# EAGLE design Arduino-Mini-v5 (EAGLE 6.1)
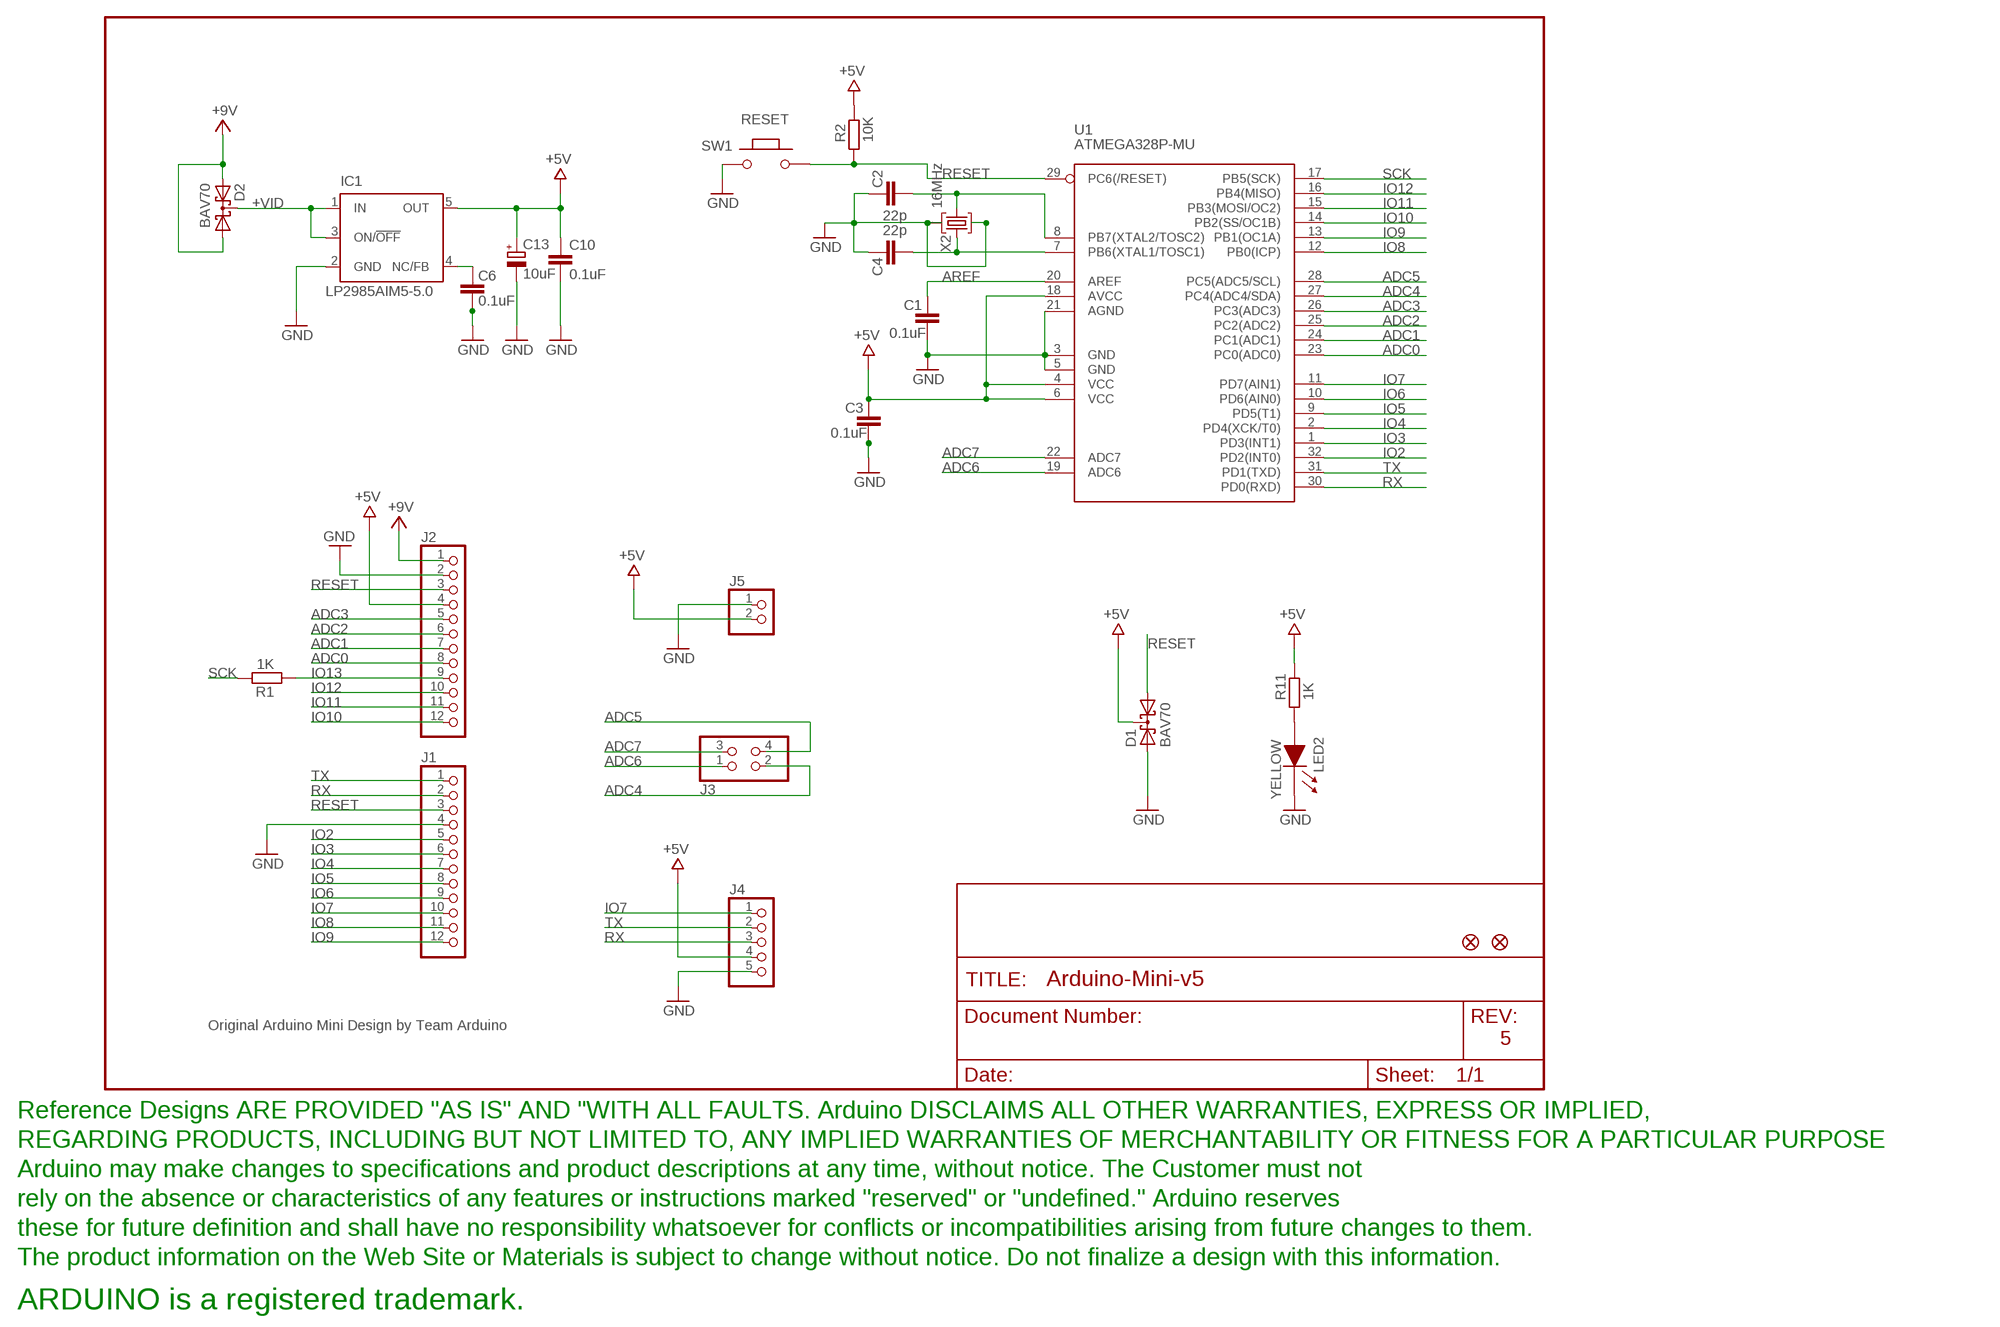
[diagram p0: schematic, sheet 1]

## Parts
C1  0.1uF  C-EUC0603  [C0603-ROUND]
C2  22p  C-EUC0603  [C0603-ROUND]
C3  0.1uF  C-EUC0603  [C0603-ROUND]
C4  22p  C-EUC0603  [C0603-ROUND]
C6  0.1uF  C-EUC0603  [C0603-ROUND]
C10  0.1uF  C-EUC0603  [C0603-ROUND]
C13  10uF  CPOL-EUSMCB  [SMC_B]
D1  BAV70  BAS70-05  [SOT23]
D2  BAV70  BAS70-05  [SOT23]
IC1  LP2985AIM5-5.0  LP2985-XXDBVR50  [SOT23-DBV]
J1  PINHD-1X12  [1X12]
J2  PINHD-1X12  [1X12]
J3  PINHD-2X2  [2X02]
J4  PINHD-1X5  [1X5]
J5  PINHD-1X2  [1X2]
LED2  YELLOW  MYSMD_LED0805  [SMD_LED0805]
R1  1K  R-EU_R0603  [R0603-ROUND]
R2  10K  R-EU_R0603  [R0603-ROUND]
R11  1K  R-EU_R0603  [R0603-ROUND]
SW1  RESET  MYSMD_PB157  [SMD_157SW]
U1  ATMEGA328P-MU  ATMEGAXX8-MU  [MLF32-M1-A]
U$2  FIDUCIAL1X2  [FIDUCIAL-1X2]
U$4  FIDUCIAL1X2  [FIDUCIAL-1X2]
U$11  DISCLAIMER  [DISCLAIMER]
X2  16MHz  CRYSTAL-3.2-2.5  [CRYSTAL-3.2-2.5]

## Nets
+5V: C3.2 C10.1 C13.+ D1.3(C) IC1.5(OUT) J2.4 J4.4 J5.2 R2.2 R11.2 U1.4(VCC) U1.6(VCC) U1.18(AVCC)
+VID: D2.3(C) IC1.1(IN) IC1.3(ON/!OFF)
ADC0: J2.8 U1.23(PC0(ADC0))
ADC1: J2.7 U1.24(PC1(ADC1))
ADC2: J2.6 U1.25(PC2(ADC2))
ADC3: J2.5 U1.26(PC3(ADC3))
ADC4: J3.2 U1.27(PC4(ADC4/SDA))
ADC5: J3.4 U1.28(PC5(ADC5/SCL))
ADC6: J3.1 U1.19(ADC6)
ADC7: J3.3 U1.22(ADC7)
AREF: C1.2 U1.20(AREF)
GND: C1.1 C2.2 C3.1 C4.2 C6.1 C10.2 C13.- D1.1(A1) IC1.2(GND) J1.4 J2.2 J4.5 J5.1 LED2.1(CA) SW1.1 U1.3(GND) U1.5(GND) U1.21(AGND) X2.2(GND) X2.4(GND)
IO2: J1.5 U1.32(PD2(INT0))
IO3: J1.6 U1.1(PD3(INT1))
IO4: J1.7 U1.2(PD4(XCK/T0))
IO5: J1.8 U1.9(PD5(T1))
IO6: J1.9 U1.10(PD6(AIN0))
IO7: J1.10 J4.1 U1.11(PD7(AIN1))
IO8: J1.11 U1.12(PB0(ICP))
IO9: J1.12 U1.13(PB1(OC1A))
IO10: J2.12 U1.14(PB2(SS/OC1B))
IO11: J2.11 U1.15(PB3(MOSI/OC2))
IO12: J2.10 U1.16(PB4(MISO))
IO13: J2.9 R1.1
N$1: C4.1 U1.7(PB6(XTAL1/TOSC1)) X2.1(C1)
N$2: C2.1 U1.8(PB7(XTAL2/TOSC2)) X2.3(C2)
N$3: C6.2 IC1.4(NC/FB)
N$4: LED2.2(AN) R11.1
RESET: D1.2(A2) J1.3 J2.3 R2.1 SW1.2 U1.29(PC6(/RESET))
RX: J1.2 J4.3 U1.30(PD0(RXD))
SCK: R1.2 U1.17(PB5(SCK))
TX: J1.1 J4.2 U1.31(PD1(TXD))
VCC: D2.1(A1) D2.2(A2) J2.1 ; supply symbol labelled +9V

## Notes on the sheet
- Original Arduino Mini Design by Team Arduino
- 5

## Library data of the parts
C1-C4 C6 C10 = Smartprj:C-EU: CAPACITOR, European symbol
C13 = Smartprj:CPOL-EU: POLARIZED CAPACITOR, European symbol
D1 D2 = diode:BAS70-05: Silicon Schottky Diodes General-purpose diode for high-speed switching
IC1 = Smartprj:LP2985-XXDBVR: ULTRALOW-POWER 50-mA LOW-DROPOUT LINEAR REGULATORS 50-mA Low-Dropout Regulator Source: http://focus.ti.com/lit/ds/symlink/tps77001.pdf
J1 J2 = Smartprj:PINHD-1X12: PIN HEADER
J3 = pinhead:PINHD-2X2: PIN HEADER
J4 = Smartprj:PINHD-1X5: PIN HEADER
J5 = LALA1:PINHD-1X2: PIN HEADER
LED2 = Smartprj:MYSMD_LED0805
R1 R2 R11 = Smartprj:R-EU_: RESISTOR, European symbol
SW1 = Smartprj:MYSMD_PB157
U1 = Smartprj:ATMEGAXX8: MICROCONTROLLER 8 Kbytes FLASH 1 kbytes SRAM 512 bytes EEPROM USART 6-channel 10 bit ADC 2-channel 8 bit ADC Source: avr.lbr
U$2 U$4 = SparkFun:FIDUCIAL: Fiducial Alignment Points Various fiducial points for machine vision alignment.
U$11 = Smartprj:DISCLAIMER
X2 = Smartprj:CRYSTAL-3.2-2.5

## Net classes
0 default: width 0.203 mm
1 vcc: width 0.254 mm

## Board
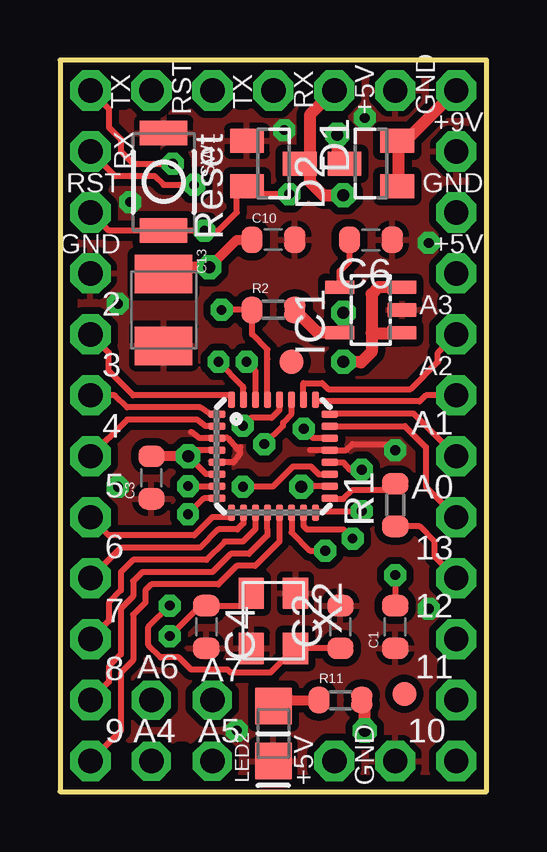
[diagram p1: board, top side]
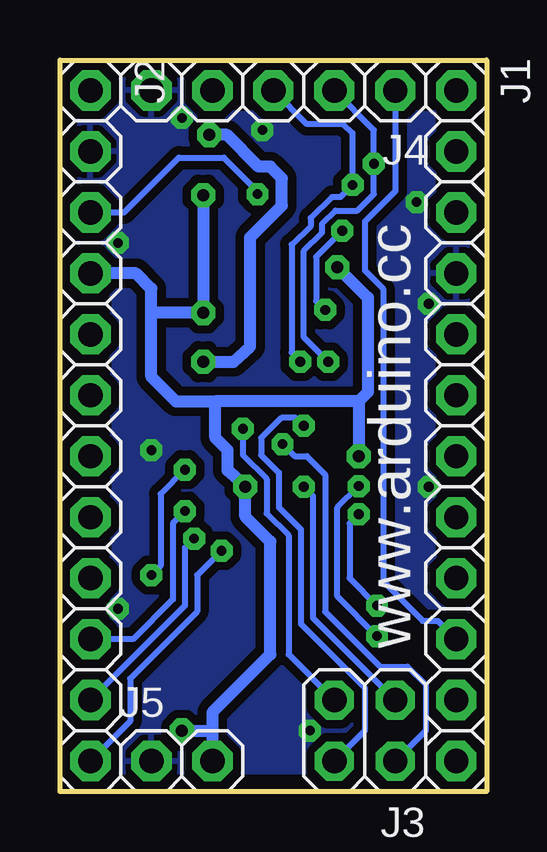
[diagram p2: board, bottom side, seen from below]

Size 17.78 x 30.48 mm. Coordinates in mm from the lower left corner, seen from the top.
Outline: 0,30.48 0,0 17.78,0 17.78,30.48 0,30.48
Copper layers (1*16): Top 0.035mm / dielectric 1.5mm / Bottom 0.035mm
Design rules: minimum track width 10mil, minimum drill 16mil, track to track 8mil, track to pad 8mil, pad to pad 8mil, via to via 8mil, smd to smd 8mil, copper to edge 24mil, drill to drill 8mil, minimum pad ring 12mil, minimum via ring 10mil, stop-mask expansion 2mil, vias tented up to drill 20mil, thermal gap 10mil
tRestrict: area 16,5 to 17.3,5.2; area 16.1,2.4 to 17.4,2.7; area 16,7.5 to 17.3,7.7; area 16,20.2 to 17.3,20.4; area 16,22.7 to 17.3,23; area 7.5,28.7 to 7.7,30; area 5,28.7 to 5.2,30; area 2.4,28.7 to 2.7,30; area 0.5,25.3 to 1.8,25.5; area 0.5,12.6 to 1.8,12.8; area 5,0.5 to 5.2,1.8; area 2.4,0.5 to 2.7,1.8
bRestrict: area 0.5,15.1 to 1.8,15.4; area 0.5,17.7 to 1.8,17.9; area 0.5,25.3 to 1.8,25.5; area 0.5,27.8 to 1.8,28.1; area 2.4,28.7 to 2.7,30; area 10,28.7 to 10.3,30; area 16,20.2 to 17.3,20.4; area 16,17.7 to 17.3,17.9; area 16,15.1 to 17.3,15.4; area 16,12.6 to 17.3,12.8; area 16,10 to 17.3,10.3; area 16,7.5 to 17.3,7.7; area 0.5,12.6 to 1.8,12.8; area 0.5,10 to 1.8,10.3

### Footprints (pad centres in the part's own frame; a part is rotated, then mirrored left to right if it is on the bottom)
C0603-ROUND = smd 0.898 x 1.1: 1 -0.889,0; 2 0.889,0
SMC_B = smd 1.6 x 2.4: + -1.5,0; - 1.5,0
SOT23 = smd 1 x 1.4: 1 -0.95,-1.1; 2 0.95,-1.1; 3 0,1.1
SOT23-DBV = smd 0.55 x 1.2: 1 -0.95,-1.3; 2 0,-1.3; 3 0.95,-1.3; 4 0.95,1.3; 5 -0.95,1.3
1X12 = drill 1.016 pad 1.676 octagon: 1 -3.81,0; 2 -1.27,0; 3 1.27,0; 4 3.81,0; 5 6.35,0; 6 8.89,0; 7 11.43,0; 8 13.97,0; 9 16.51,0; 10 19.05,0; 11 21.59,0; 12 24.13,0
2X02 = drill 1.016 octagon: 1 -1.27,-1.27; 2 -1.27,1.27; 3 1.27,-1.27; 4 1.27,1.27
1X5 = drill 1.016 pad 1.676 octagon: 1 -3.81,0; 2 -1.27,0; 3 1.27,0; 4 3.81,0; 5 6.35,0
1X2 = drill 1.016 pad 1.676 octagon: 1 -3.81,0; 2 -1.27,0
SMD_LED0805 = smd 1.524 x 1.524: 1 0,0; 2 2.286,0
R0603-ROUND = smd 0.898 x 1.1: 1 -0.889,0; 2 0.889,0
SMD_157SW = smd 1.016 x 1.981: 1 -2.032,0; 2 2.032,0
MLF32-M1-A = smd 0.7 x 0.3: 1 -2.35,1.75; 2 -2.35,1.25; 3 -2.35,0.75; 4 -2.35,0.25; 5 -2.35,-0.25; 6 -2.35,-0.75; 7 -2.35,-1.25; 8 -2.35,-1.75; 17 2.35,-1.75; 18 2.35,-1.25; 19 2.35,-0.75; 20 2.35,-0.25; 21 2.35,0.25; 22 2.35,0.75; 23 2.35,1.25; 24 2.35,1.75 | smd 0.3 x 0.7: 9 -1.75,-2.35; 10 -1.25,-2.35; 11 -0.75,-2.35; 12 -0.25,-2.35; 13 0.25,-2.35; 14 0.75,-2.35; 15 1.25,-2.35; 16 1.75,-2.35; 25 1.75,2.35; 26 1.25,2.35; 27 0.75,2.35; 28 0.25,2.35; 29 -0.25,2.35; 30 -0.75,2.35; 31 -1.25,2.35; 32 -1.75,2.35
FIDUCIAL-1X2 = smd 1 x 1: 1 0,0
CRYSTAL-3.2-2.5 = smd 1.3 x 1.05: 1 -1.15,-0.925; 2 1.15,-0.925; 3 1.15,0.925; 4 -1.15,0.925

### Placement (x,y rotation side)
C1  13.97,6.86 90 top
C2  11.68,6.86 90 top
C3  3.81,13.08 90 top
C4  6.1,6.86 270 top
C6  12.95,22.99 180 top
C10  8.89,22.99 0 top
C13  4.32,20.07 270 top
D1  8.89,26.16 270 top
D2  12.95,26.16 90 top
IC1  12.95,20.07 90 top
J1  1.27,25.4 270 bottom
J2  16.51,25.4 270 bottom
J3  5.08,2.54 180 bottom
J4  7.62,29.21 180 bottom
J5  10.16,1.27 0 bottom
LED2  8.89,1.27 90 top
R1  13.97,11.94 90 top
R2  8.89,20.07 0 top
R11  11.68,3.81 0 top
SW1  4.32,25.4 270 top
U1  8.89,13.97 0 top
U$2  14.35,4.06 0 top
U$4  9.65,17.91 0 top
U$11  -7.75,-25.78 0 top  (outside the outline)
X2  8.89,7.11 270 top

### Tracks (layer width: path | path; a pad name or v marks a point on that pad's centre or on a via)
+5V  (via drill 0.5)
  Top 0.254: 6.6,13.21 U1.6 6.08,13.22 v5.33,13.97 5.59,14.22 6.35,14.22 U1.4 6.6,14.22 | U1.18 10.16,12.72 | 3.94,13.97 C3.2
  Top 0.406: v6.22,21.84 7.37,22.99 C10.1 | v5.33,13.97 3.94,13.97
  Top 0.508: 10.41,26.16 10.41,28.19 J4.4 | v11.81,24.84 10.97,24.84 10.41,25.4 10.41,26.16 | 10.41,26.16 D1.3 | v12.7,2.54 12.7,3.81 R11.2 | v6.22,21.84 4.32,21.84 C13.+ | 10.16,12.72 v10.06,12.7 | R2.2 10.72,19.13 11.64,19.13 IC1.5 11.67,19.1 | v11.81,19.94 11.81,19.15 11.38,19.1 11.67,19.1 | 11.68,19.1 11.67,19.1
  Bottom 0.508: v11.81,24.84 v11.81,19.94 13.97,19.94 | 13.97,19.94 13.97,20.95 14.61,21.59 J2.4 | 13.97,19.94 13.97,17.27 12.95,16.26 11.3,16.26 | 5.33,16.26 v5.33,13.97 | 5.33,16.26 4.95,16.64 4.95,20.57 v6.22,21.84 | 5.33,16.26 11.3,16.26 | 11.3,16.26 11.3,14.73 10.79,14.22 10.79,13.39 v10.06,12.7 10.06,11.46 9.02,10.41 9.02,5.71 11.43,3.3 11.43,2.54 | 11.43,2.54 J5.2 | v12.7,2.54 11.43,2.54
+VID  (via drill 0.5)
  Top 0.508: 14.22,19.1 IC1.1 14.22,19.1 | 14.28,21.03 IC1.3 13.27,21.02 12.98,20.73 12.98,19.1 | v11.56,27.36 11.56,26.16 D2.3 | v11.81,17.91 12.55,17.88 12.98,18.31 12.98,19.1 | 12.98,19.1 14.22,19.1
  Bottom 0.508: v11.81,17.91 10.54,17.91 9.86,18.54 9.86,23.09 8.53,24.41 8.53,25.55 9.02,26.04 9.5,26.04 10.82,27.36 v11.56,27.36
ADC0
  Top 0.254: U1.23 14.37,15.22 15.24,14.35 15.24,12.7 J2.8
ADC1
  Top 0.254: J2.7 14.73,15.75 11.43,15.75 U1.24
ADC2
  Top 0.254: J2.6 15.24,16.51 14.99,16.26 10.67,16.26 U1.25
ADC3
  Top 0.254: U1.26 10.14,17.02 10.92,17.02 11.18,16.76 14.61,16.76 15.75,17.91 15.75,18.29 J2.5
ADC4  (via drill 0.41)
  Top 0.254: v8.51,14.48 9.3,15.24 9.3,15.37 9.65,15.75 9.65,16.26 U1.27
  Bottom 0.254: v8.51,14.48 8,13.97 7.49,13.97 6.73,13.21 6.73,7.49 4.45,5.21 3.3,5.21 2.54,4.45 2.54,2.54 J3.2
ADC5  (via drill 0.41)
  Top 0.254: U1.28 9.14,15.9 8.81,15.57 7.95,15.57 v7.62,15.24
  Bottom 0.254: v7.62,15.24 7.95,15.57 8.56,15.57 9.4,14.73 9.4,14.02 8.66,13.28 8.66,11.84 7.75,10.92 7.75,6.99 5.08,4.32 5.08,2.54 J3.4
ADC6  (via drill 0.41)
  Top 0.254: v7.62,12.7 8.87,12.7 9.7,13.54 10.46,13.54 10.79,13.21 11.18,13.21 U1.19
  Bottom 0.254: v7.62,12.7 7.24,12.32 7.24,7.24 J3.1
ADC7  (via drill 0.41)
  Top 0.254: U1.22 11.18,14.73 10.54,14.73 v10.16,15.11
  Bottom 0.254: v10.16,15.11 10.16,14.02 9.17,13.03 9.17,11.58 8.26,10.67 8.26,5.71 J3.3
AREF  (via drill 0.41)
  Top 0.254: v13.97,9.02 C1.2 | v12.57,13.41 12.06,13.41 11.81,13.72 11.43,13.72 U1.20
  Bottom 0.254: v13.97,9.02 13.59,9.4 13.59,12.39 v12.57,13.41
GND  (via drill 0.41)
  Top 0.254: 6.1,14.73 6.35,14.73 U1.3 | 6.1,14.73 6.04,14.72 | v13.97,14.22 13.72,14.48 12.19,14.48 11.93,14.22 U1.21 10.93,14.22 10.92,14.22 10.42,14.22 10.41,14.22 | U1.3 6.1,14.73 | 7.39,14.28 6.99,14.73 6.55,14.73 U1.3 | 7.39,14.28 arc-45 7.51,14.11 7.24,13.72 U1.5 arc-45 U1.5 | 7.49,14.22 7.52,14.35 7.39,14.28 | U1.3 5.83,14.72 5.46,14.99
  other vias: 15.37,22.86 2.41,12.7 15.37,7.62 2.92,24.56 2.41,20.32 7.37,2.54 12.7,28.07 9.35,27.56
  pour Top (isolate 0.305): 0,30.48 17.78,30.48 17.78,0 0,0
  pour Bottom (isolate 0.356): 0,30.48 17.78,30.48 17.78,0 0,0
IO2
  Top 0.254: J1.5 2.03,18.29 2.03,17.53 3.05,16.51 7.11,16.51 U1.32
IO3
  Top 0.254: J1.6 2.29,16.51 2.79,16 5.84,16 6.25,15.72 U1.1
IO4
  Top 0.254: U1.2 6.08,15.22 5.71,15.49 2.79,15.49 J1.7
IO5
  Top 0.254: U1.9 7.11,11.43 6.35,11.43 5.59,10.67 2.03,10.67 J1.8
IO6
  Top 0.254: U1.10 7.64,11.18 7.39,10.92 6.6,10.92 5.84,10.16 2.54,10.16 J1.9
IO7
  Top 0.254: U1.11 8.14,10.93 7.62,10.41 6.86,10.41 6.1,9.65 3.05,9.65 2.54,9.14 2.54,8.38 2.03,7.87 2.03,7.11 J1.10
  Bottom 0.254: J4.1 3.81,25.02 5.08,23.75 5.08,21.72 4.32,20.95 4.32,8.76 2.67,7.11 2.03,7.11 J1.10
IO8
  Top 0.254: J1.11 2.03,4.57 2.03,5.21 2.54,5.71 2.54,7.62 3.05,8.13 3.05,8.76 3.43,9.14 6.35,9.14 7.11,9.91 7.87,9.91 8.64,10.67 8.64,10.92 U1.12
IO9
  Top 0.254: U1.13 9.14,11.43 9.14,10.41 8.13,9.4 7.37,9.4 6.6,8.64 3.81,8.64 3.56,8.38 3.56,7.87 3.05,7.37 3.05,5.46 2.54,4.95 2.54,2.54 J1.12
IO10  (via drill 0.41)
  Top 0.254: v11.05,10.03 10.41,10.03 9.65,10.79 9.65,11.43 U1.14
  Bottom 0.254: J2.12 14.86,2.92 14.86,4.7 12.06,7.49 12.06,9.02 v11.05,10.03
IO11  (via drill 0.41)
  Top 0.254: U1.15 10.14,11.07 10.29,10.92 11.81,10.92 v12.19,10.54
  Bottom 0.254: v12.19,10.54 12.57,10.16 12.57,7.75 J2.11
IO12  (via drill 0.41)
  Top 0.254: v12.57,11.68 10.67,11.68 U1.16
  Bottom 0.254: J2.10 14.73,6.35 13.08,8 13.08,11.18 v12.57,11.68
IO13
  Top 0.254: R1.1 14.99,11.05 15.62,10.41 15.62,9.78 J2.9
N$1  (via drill 0.41)
  Top 0.254: v5.33,12.72 U1.7 | v4.57,6.48 5.84,7.75 C4.1 7.49,7.75 8,8.26 X2.1
  Bottom 0.254: v4.57,6.48 6.22,8.13 6.22,11.84 v5.33,12.72
N$2  (via drill 0.41)
  Top 0.254: 6.35,12.19 U1.8 6.25,12.22 5.99,12.22 v5.33,11.56 | C2.1 X2.3 9.77,5.96 8.76,4.95 7.11,4.95 6.99,5.08 5.46,5.08 4.95,5.59 4.19,5.59 3.68,6.1 3.68,6.86 v4.57,7.75
  Bottom 0.254: v5.33,11.56 5.71,11.18 5.71,8.89 v4.57,7.75
N$3
  Top 0.254: IC1.4 11.65,21.69 12.06,22.1 C6.2
N$4
  Top 0.254: 9.65,3.81 9.4,3.56 LED2.2
  Top 0.406: 9.65,3.81 R11.1
RESET  (via drill 0.41)
  Top 0.254: D1.2 7.37,24.77 7.37,24.13 6.6,23.37 v6.02,23.37 SW1.2 2.03,23.37 J1.3 | 7.62,25.15 D1.2 | U1.29 8.64,18.03 8.64,18.41 8,19.05 R2.1 | R2.1 v6.73,20.07 | 8,20.12 R2.1 | v9.55,24.89 7.75,24.89 7.75,25.15 7.79,25.19 D1.2
  Bottom 0.254: v6.02,23.37 7.11,22.28 7.11,20.45 v6.73,20.07 | J2.3 15.11,24.13 12.83,26.42 10.95,26.42 9.55,24.99 v9.55,24.89
RX  (via drill 0.41)
  Top 0.254: v5.59,25.27 4.32,25.27 3.94,25.65 2.29,25.65 J1.2 | v7.77,17.91 8.13,17.55 8.13,16.51 U1.30
  Bottom 0.254: J4.3 7.49,27.81 5.97,27.81 5.59,27.43 v5.59,25.27 6.1,24.77 6.45,24.77 7.34,23.9 7.34,23.55 8.13,22.78 8.13,18.29 7.77,17.93 v7.77,17.91
SCK
  Top 0.254: R1.2 13.84,12.57 12.19,12.57 11.81,12.19 11.43,12.19 U1.17
TX  (via drill 0.41)
  Top 0.254: U1.31 7.64,16.82 7.62,16.87 v6.6,17.91 | J1.1 2.03,28.45 2.03,27.69 2.54,27.18 2.54,26.67 3.05,26.16 v4.7,26.16
  Bottom 0.254: v6.6,17.91 7.62,18.92 7.62,22.53 6.86,23.29 6.86,23.65 6.3,24.21 5.38,24.21 4.7,24.89 v4.7,26.16 4.7,27.56 J4.2
VCC
  Top 0.254: 14.1,26.92 13.72,26.92 13.72,27.18 13.97,27.18 D2.2 14.22,27.18 14.48,27.18 | 14.1,25.27 D2.1
  Top 0.508: 14.1,26.92 14.1,25.27 | J2.1 14.48,27.18

### Text on the board
tPlace: TX | RST | TX | RX | +5V | GND | +9V | RST | RX | GND | GND | Reset | +5V | 2 | A3 | 3 | A2 | 4 | A1 | 5 | A0 | 6 | 13 | 7 | 12 | 8 | A6 | A7 | 11 | 9 | A5 | A4 | 10 | +5V | GND
bPlace: www.arduino.cc
tValues: Tent Vias! | Arduino Wee v1.3